# Altium schematic sheet ControleLeds.SchDoc: CONTROLADORA AIRPOPCORN
size A3; DocumentNumber: 3; SheetNumber: 3; SheetTotal: 15
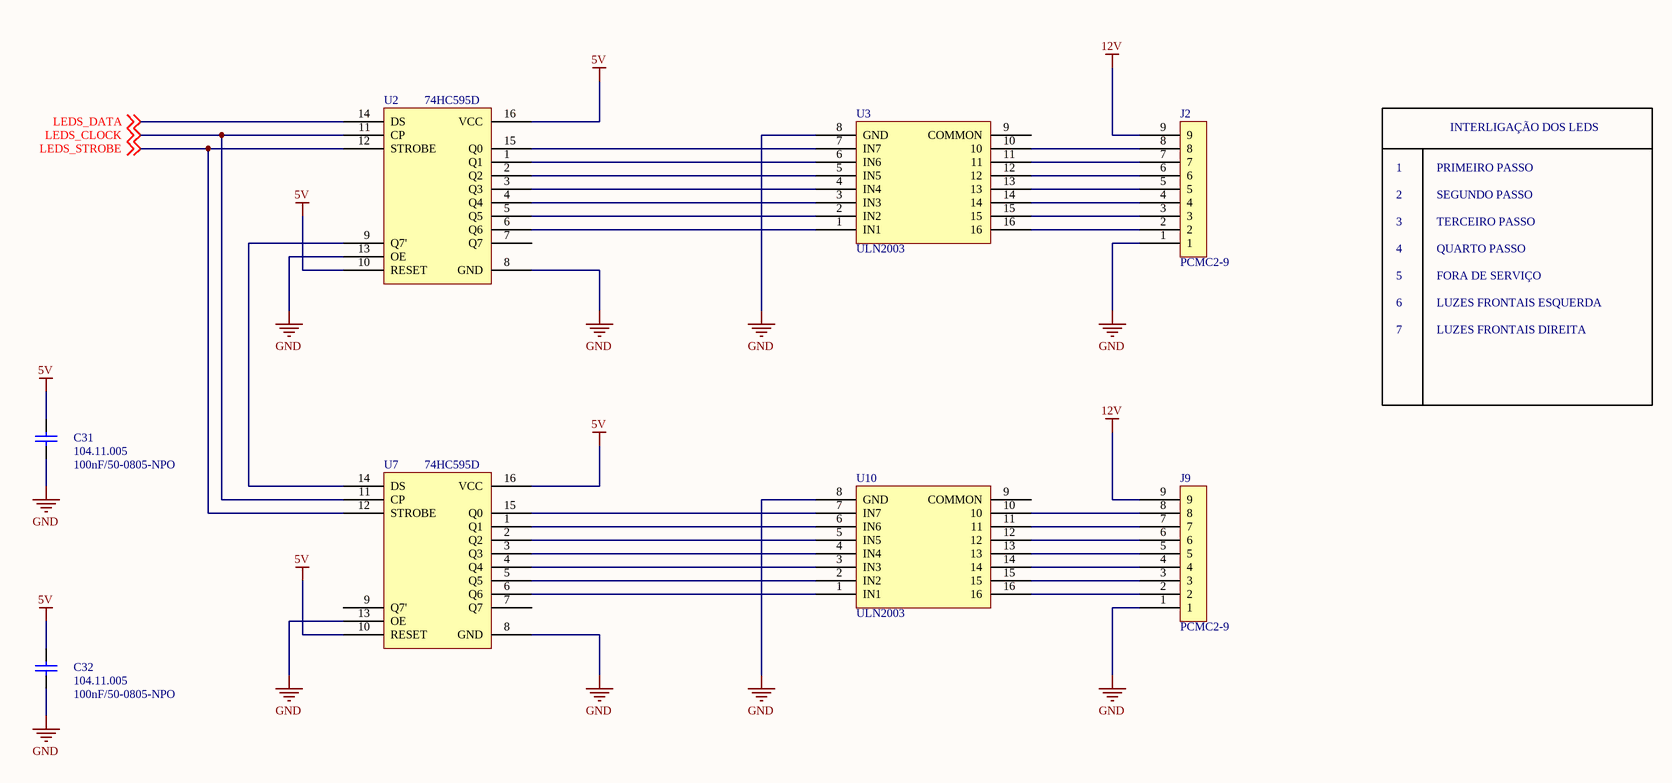
[diagram p0: ControleLeds.SchDoc]

## Parts
C31  100nF/50-0805-NPO  ERP: 104.11.005  [0805-REVISADO ONDA]
C32  100nF/50-0805-NPO  ERP: 104.11.005  [0805-REVISADO ONDA]
J2  PCMC2-9  [PCMC2-9]
J9  PCMC2-9  [PCMC2-9]
U2  74HC595D  [SOIC 16 PINOS]
U3  ULN2003  [SOIC 16 PINOS]
U7  74HC595D  [SOIC 16 PINOS]
U10  ULN2003  [SOIC 16 PINOS]

## Nets
5V: C31.2 C32.2 U2.10(RESET) U2.16(VCC) U7.10(RESET) U7.16(VCC)
12V: J2.9 J9.9
GND: C31.1 C32.1 J2.1 J9.1 U2.8(GND) U2.13(OE) U3.8(GND) U7.8(GND) U7.13(OE) U10.8(GND)
LEDS_CLOCK: U2.11(CP) U7.11(CP) ; off-sheet LEDS_CLOCK
LEDS_DATA: U2.14(DS) ; off-sheet LEDS_DATA
LEDS_STROBE: U2.12(STROBE) U7.12(STROBE) ; off-sheet LEDS_STROBE
NetJ2_2: J2.2 U3.16
NetJ2_3: J2.3 U3.15
NetJ2_4: J2.4 U3.14
NetJ2_5: J2.5 U3.13
NetJ2_6: J2.6 U3.12
NetJ2_7: J2.7 U3.11
NetJ2_8: J2.8 U3.10
NetJ9_2: J9.2 U10.16
NetJ9_3: J9.3 U10.15
NetJ9_4: J9.4 U10.14
NetJ9_5: J9.5 U10.13
NetJ9_6: J9.6 U10.12
NetJ9_7: J9.7 U10.11
NetJ9_8: J9.8 U10.10
NetU2_1: U2.1(Q1) U3.6(IN6)
NetU2_2: U2.2(Q2) U3.5(IN5)
NetU2_3: U2.3(Q3) U3.4(IN4)
NetU2_4: U2.4(Q4) U3.3(IN3)
NetU2_5: U2.5(Q5) U3.2(IN2)
NetU2_6: U2.6(Q6) U3.1(IN1)
NetU2_9: U2.9(Q7') U7.14(DS)
NetU2_15: U2.15(Q0) U3.7(IN7)
NetU7_1: U7.1(Q1) U10.6(IN6)
NetU7_2: U7.2(Q2) U10.5(IN5)
NetU7_3: U7.3(Q3) U10.4(IN4)
NetU7_4: U7.4(Q4) U10.3(IN3)
NetU7_5: U7.5(Q5) U10.2(IN2)
NetU7_6: U7.6(Q6) U10.1(IN1)
NetU7_15: U7.15(Q0) U10.7(IN7)

Not connected (* = marked no-connect by the designer): U2 7(Q7); U3 9(COMMON); U7 7(Q7) 9(Q7'); U10 9(COMMON)

## Notes on the sheet
- INTERLIGAÇÃO DOS LEDS
- 1
- 2
- 3
- PRIMEIRO PASSO
- SEGUNDO PASSO
- TERCEIRO PASSO
- 4
- 5
- QUARTO PASSO
- FORA DE SERVIÇO
- 6
- 7
- LUZES FRONTAIS ESQUERDA
- LUZES FRONTAIS DIREITA
- NOME
- DATA
- PROJETO
- DESCRIÇÃO
- desenho
- verif.
- aprov.
- TAMANHO
- CODIGO
- Todas as informações disponíveis
- não devem ser divulgadas,
- em parte ou todo.
- CIRCUITO IMPRESSO
- MONTAGEM ELETRÔNICA
- A4
- de

## Library data of the parts
U2 U7 = 74HC595D: ERP: CADASTRAR